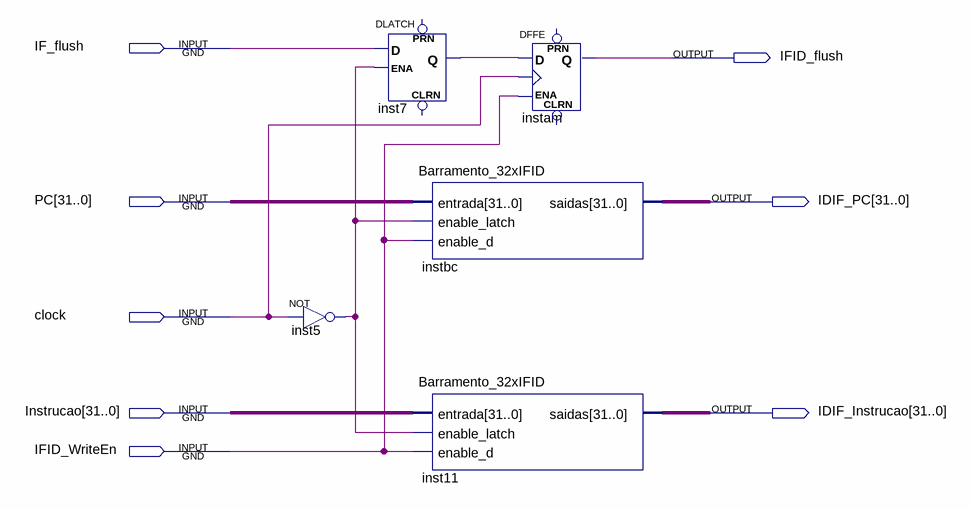
[diagram p0: schematic sheet]
// Quartus schematic IF_ID.bdf as structural Verilog: 5 symbols, 8 pins
module IF_ID (
  input  IF_flush,
  input  [31:0] PC,
  input  clock,
  input  [31:0] Instrucao,
  input  IFID_WriteEn,
  output IFID_flush,
  output [31:0] IDIF_PC,
  output [31:0] IDIF_Instrucao
);

  wire inst5_out, inst7_q;

  not inst5 (inst5_out, clock);
  DLATCH inst7 (.D(IF_flush), .ENA(inst5_out), .Q(inst7_q));  // open: CLRN, PRN
  Barramento_32xIFID instbc (.entrada(PC), .enable_latch(inst5_out), .enable_d(IFID_WriteEn), .saidas(IDIF_PC));
  Barramento_32xIFID inst11 (
    .entrada(Instrucao), .enable_latch(inst5_out), .enable_d(IFID_WriteEn), .saidas(IDIF_Instrucao));
  DFFE instam (.D(inst7_q), .CLK(clock), .ENA(IFID_WriteEn), .Q(IFID_flush));  // open: PRN, CLRN
endmodule
